# EasyEDA Pro project ProPrj_灯板_2025-12-07.epro

# Schematic Schematic1
Board Name: Board1; Create Date: 2025-11-25; Page Name: P1; Project Name: 灯板; Schematic Name: Schematic1; Update Date: 2025-11-25; Company: 嘉立创EDA; Page Size: A4; Version: V1.0
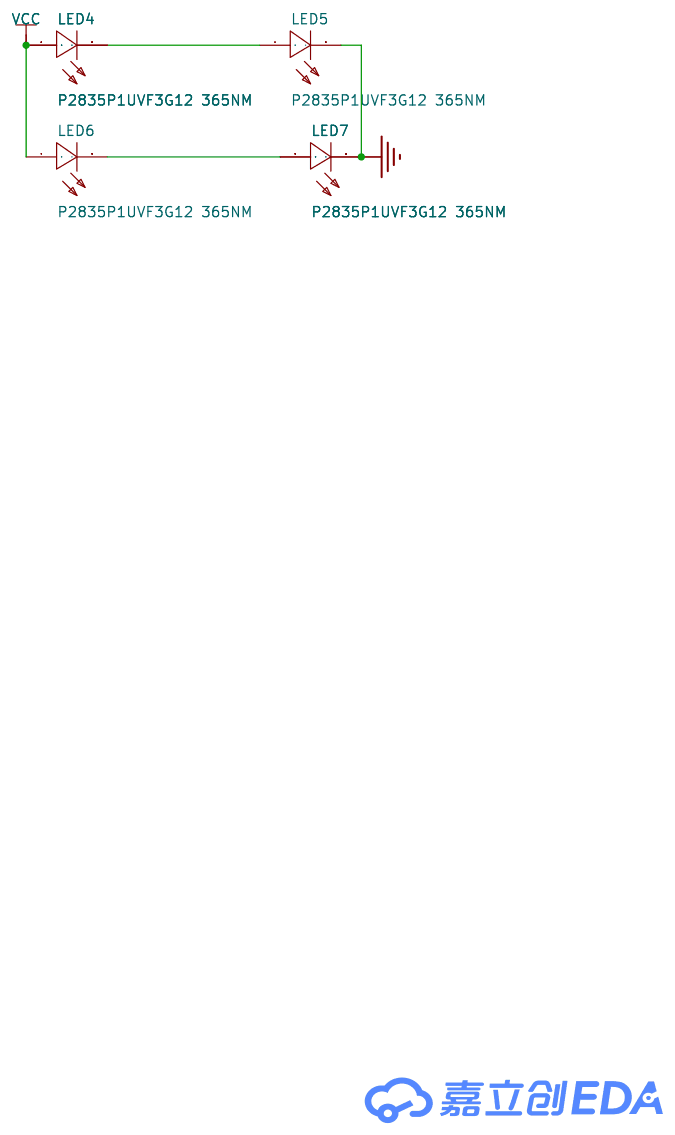
[diagram p0: schematic sheet]

## Parts
LED4  P2835P1UVF3G12 365NM  [LED-SMD_L3.5-W2.8-R-RD_TJ-S2835UG5W8TLC6B-A5]
LED5  P2835P1UVF3G12 365NM  [LED-SMD_L3.5-W2.8-R-RD_TJ-S2835UG5W8TLC6B-A5]
LED6  P2835P1UVF3G12 365NM  [LED-SMD_L3.5-W2.8-R-RD_TJ-S2835UG5W8TLC6B-A5]
LED7  P2835P1UVF3G12 365NM  [LED-SMD_L3.5-W2.8-R-RD_TJ-S2835UG5W8TLC6B-A5]

## Library data of the parts
LED4-LED7 = P2835P1UVF3G12 365NM: 特性：封装尺寸 2.8 × 3.5 × 0.6 mm。 焊接方式：回流焊。 符合RoHS标准。 采用纯金线焊线。应用：灭蚊灯、美甲灯。 油墨、UV胶水、油漆等需要快速、高效固化的领域; LCSC Part Name: 2835UVA紫外LED; Supplier Part: C2915615; Manufacturer: Silverlight(银月光); Supplier Footprint: SMD2835; JLCPCB Part Class: 扩展库; Datasheet: https://item.szlcsc.com/datasheet/P2835P1UVF3G12%2520365NM/3209179.html; Supplier: LCSC

## Nets
GND: LED5.2(-) LED7.2(-)
VCC: LED4.1(+) LED6.1(+)
Net-(LED4-2): LED4.2(-) LED5.1(+)
Net-(LED6-2): LED6.2(-) LED7.1(+)

# Board PCB1
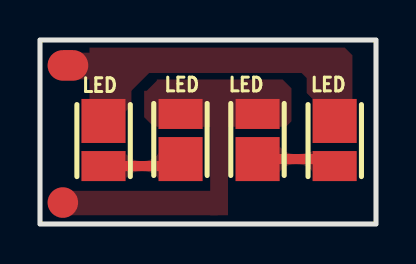
[diagram p1: board, top side]
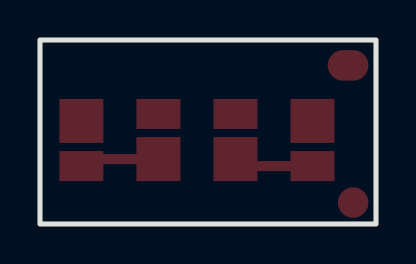
[diagram p2: board, bottom side, seen from below]

Outline 16.8 x 9.2 mm; copper layers: Top Layer, Bottom Layer. Coordinates in mm from the lower left corner of the outline.
Outline path: rectangle 0,9.2 16.8,0
Stack: Top Layer 0.035mm / Dielectric1 1.51mm FR4 er 4.5 / Bottom Layer 0.035mm

## Design rules (mm)
template: JLCPCB Capability(Two Layers Board)
spacing copperThickness1oz (default): track to track 0.102, other pairs 0.152 to 0.3
spacing copperThickness2oz: track to track 0.203, other pairs 0.152 to 0.3
track width copperThickness1oz (default): min 0.127, default 0.254, max 2.54
track width copperThickness2oz: min 0.203, default 0.254, max 2.54
differential pair differentialPair (default): width min 0.127, default 0.254, max 2.54; gap min 0.152, default 0.152
via viaSize (default): diameter min 0.5, default 0.61, max 10; hole min 0.3, default 0.305, max 6.3

## Placement (name value [footprint] x y rotation side)
LED  -  [LED-SMD_L3.5-W2.8-R-RD_TJ-S2835UG5W8TLC6B-A5]  7.03 4.37 90 top
LED#2  -  [LED-SMD_L3.5-W2.8-R-RD_TJ-S2835UG5W8TLC6B-A5]  3.18 4.02 270 top
LED#3  -  [LED-SMD_L3.5-W2.8-R-RD_TJ-S2835UG5W8TLC6B-A5]  10.88 4.37 90 top
LED#4  -  [LED-SMD_L3.5-W2.8-R-RD_TJ-S2835UG5W8TLC6B-A5]  14.73 4.02 270 top
NOREF  -  [Pad_e146]  1.4 7.93 0 top
NOREF#2  -  [Pad_e134]  1.14 1.07 0 top

## Footprints (pads in the part's own frame, mm; a bottom-side part is the same pattern mirrored in y, then rotated)
LED-SMD_L3.5-W2.8-R-RD_TJ-S2835UG5W8TLC6B-A5
  rect 1.5x2.2 smd: 1(1.128,0)
  rect 2.2x2.2 smd: 2(-1.128,0)
Pad_e134
  round 1.524 smd: 1(0,0)
Pad_e146
  oval 2.032x1.524 smd: 1(0,0)

## Nets
GND: LED#2.2 LED#4.2 NOREF.1
VCC: LED.1 LED#3.1 NOREF#2.1
$1N557: LED.2 LED#2.1
$1N566: LED#3.2 LED#4.1

## Routing (per net, layer and track width the routed paths; a pad name or vN(x,y) marks a point on that pad's centre or on a via; arc(x,y) is an arc through that point)
$1N557: length 4.1
  Top Layer w0.508: 7.11,3.25 6.76,2.9 LED#2.1
$1N566: length 3.6
  Top Layer w0.254: 14.38,3.25 LED#4.1
  Top Layer w0.508: 11.3,3.25 14.38,3.25

## Copper pours and planes (outline as drawn; the poured copper is in the pictures)
GND on Top Layer: 2.47,8.82 15.62,8.82 15.62,5.15 2.47,5.15
GND on Top Layer: 0.97,8.56 3.81,8.56 3.81,7.23 0.97,7.23
VCC on Top Layer: 5.21,7.23 12.57,7.23 12.57,4.86 5.21,4.86
VCC on Top Layer: 8.51,6.04 9.4,6.04 9.4,0.44 8.51,0.44
VCC on Top Layer: 0.76,1.66 8.89,1.66 8.89,0.44 0.76,0.44

Small or netless copper shapes (teardrops, artwork), in the pictures only: 4 on Top Layer
